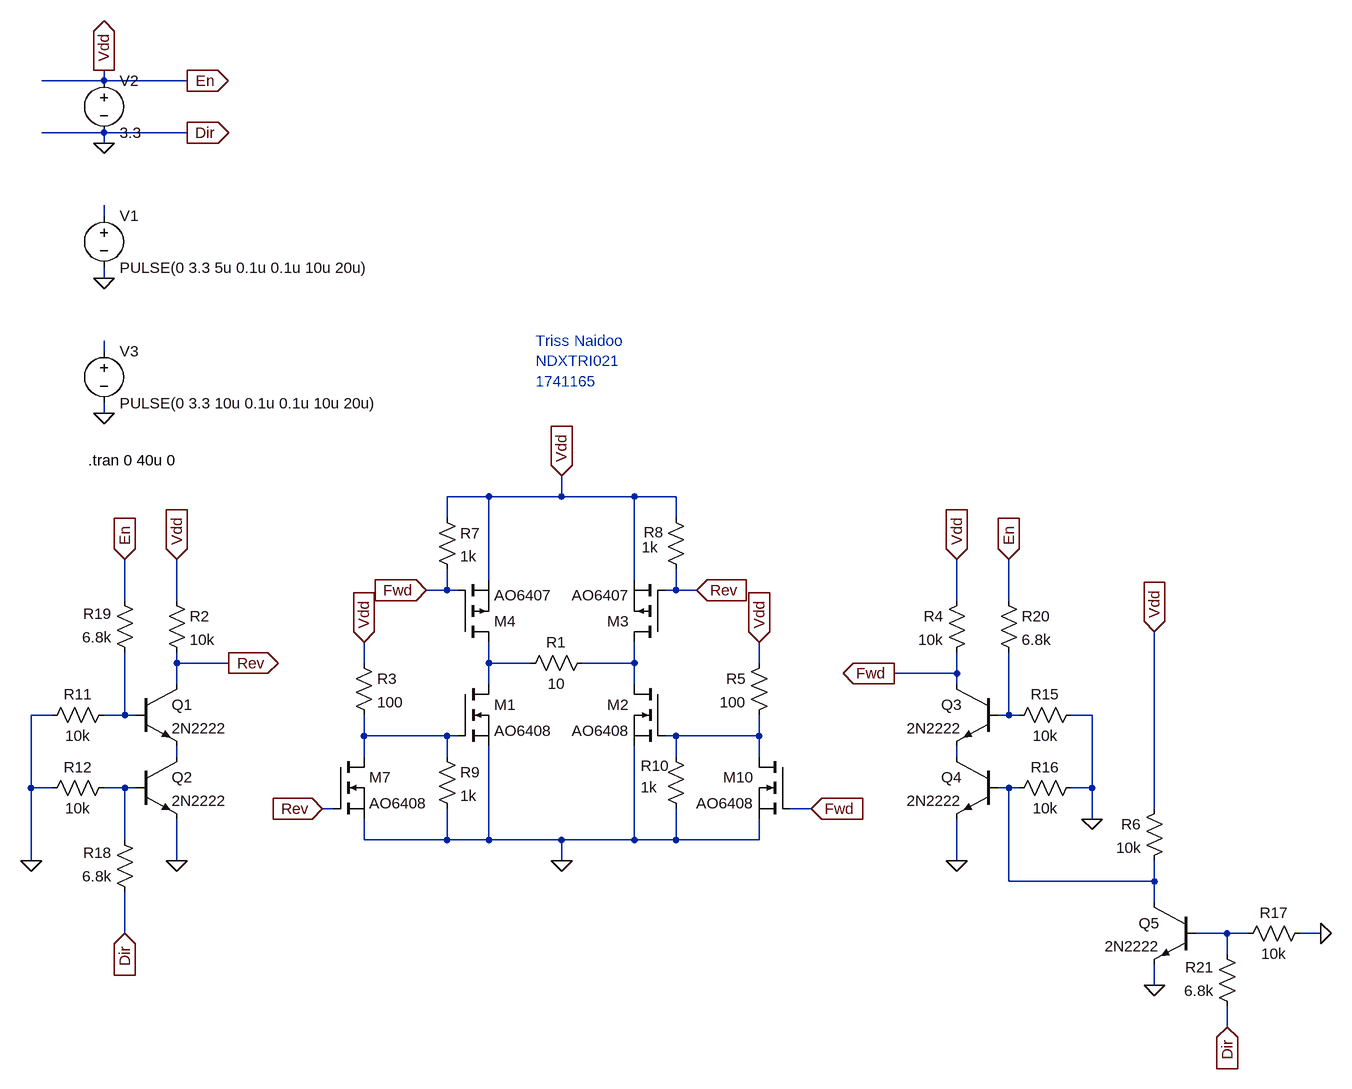
[diagram p0: schematic EEE3088F_MOSFET_Driver_Simulation.asc]
EEE3088F_MOSFET_Driver_Simulation.asc, the LTspice schematic file:
Version 4
SHEET 1 2004 812
WIRE 48 -736 48 -752
WIRE 48 -736 -48 -736
WIRE 176 -736 48 -736
WIRE 48 -656 -48 -656
WIRE 176 -656 48 -656
WIRE 48 -640 48 -656
WIRE 48 -528 48 -544
WIRE 48 -432 48 -448
WIRE 48 -320 48 -336
WIRE 48 -224 48 -240
WIRE 640 -96 576 -96
WIRE 752 -96 752 -128
WIRE 752 -96 640 -96
WIRE 864 -96 752 -96
WIRE 928 -96 864 -96
WIRE 576 -64 576 -96
WIRE 928 -64 928 -96
WIRE 640 32 640 -96
WIRE 864 32 864 -96
WIRE 576 48 576 16
WIRE 576 48 544 48
WIRE 592 48 576 48
WIRE 928 48 928 16
WIRE 928 48 912 48
WIRE 960 48 928 48
WIRE 80 64 80 0
WIRE 160 64 160 0
WIRE 1360 64 1360 0
WIRE 1440 64 1440 0
WIRE 160 160 160 144
WIRE 240 160 160 160
WIRE 448 160 448 128
WIRE 640 160 640 128
WIRE 704 160 640 160
WIRE 864 160 864 128
WIRE 864 160 784 160
WIRE 1056 160 1056 128
WIRE 1360 176 1360 144
WIRE 1360 176 1264 176
WIRE 160 192 160 160
WIRE 640 192 640 160
WIRE 864 192 864 160
WIRE 1360 192 1360 176
WIRE -32 240 -64 240
WIRE 80 240 80 144
WIRE 80 240 48 240
WIRE 96 240 80 240
WIRE 1440 240 1440 144
WIRE 1440 240 1424 240
WIRE 1456 240 1440 240
WIRE 1568 240 1536 240
WIRE 448 272 448 240
WIRE 576 272 448 272
WIRE 592 272 576 272
WIRE 928 272 912 272
WIRE 1056 272 1056 240
WIRE 1056 272 928 272
WIRE 160 304 160 288
WIRE 448 304 448 272
WIRE 576 304 576 272
WIRE 928 304 928 272
WIRE 1056 304 1056 272
WIRE 1360 304 1360 288
WIRE -64 352 -64 240
WIRE -32 352 -64 352
WIRE 80 352 48 352
WIRE 96 352 80 352
WIRE 1440 352 1424 352
WIRE 1456 352 1440 352
WIRE 1568 352 1568 240
WIRE 1568 352 1536 352
WIRE 400 384 384 384
WIRE 1136 384 1104 384
WIRE 1664 384 1664 112
WIRE 1568 400 1568 352
WIRE 80 432 80 352
WIRE 448 432 448 400
WIRE 576 432 576 384
WIRE 576 432 448 432
WIRE 640 432 640 288
WIRE 640 432 576 432
WIRE 752 432 640 432
WIRE 864 432 864 288
WIRE 864 432 752 432
WIRE 928 432 928 384
WIRE 928 432 864 432
WIRE 1056 432 1056 400
WIRE 1056 432 928 432
WIRE -64 464 -64 352
WIRE 160 464 160 400
WIRE 752 464 752 432
WIRE 1360 464 1360 400
WIRE 1440 496 1440 352
WIRE 1664 496 1664 464
WIRE 1664 496 1440 496
WIRE 1664 528 1664 496
WIRE 80 576 80 512
WIRE 1776 576 1728 576
WIRE 1808 576 1776 576
WIRE 1920 576 1888 576
WIRE 1776 608 1776 576
WIRE 1664 656 1664 624
WIRE 1776 720 1776 688
FLAG 752 464 0
FLAG 752 -128 Vdd
IOPIN 752 -128 In
FLAG 48 -640 0
FLAG 48 -432 0
FLAG 176 -736 En
IOPIN 176 -736 Out
FLAG 48 -752 Vdd
IOPIN 48 -752 Out
FLAG 48 -224 0
FLAG 176 -656 Dir
IOPIN 176 -656 Out
FLAG 1664 656 0
FLAG 1920 576 0
FLAG 448 128 Vdd
IOPIN 448 128 In
FLAG 1056 128 Vdd
IOPIN 1056 128 In
FLAG 160 0 Vdd
IOPIN 160 0 In
FLAG 1360 0 Vdd
IOPIN 1360 0 In
FLAG 1664 112 Vdd
IOPIN 1664 112 In
FLAG 160 464 0
FLAG 1360 464 0
FLAG -64 464 0
FLAG 1568 400 0
FLAG 240 160 Rev
IOPIN 240 160 Out
FLAG 960 48 Rev
IOPIN 960 48 In
FLAG 384 384 Rev
IOPIN 384 384 In
FLAG 544 48 Fwd
IOPIN 544 48 In
FLAG 1136 384 Fwd
IOPIN 1136 384 In
FLAG 1264 176 Fwd
IOPIN 1264 176 Out
FLAG 80 0 En
IOPIN 80 0 In
FLAG 1440 0 En
IOPIN 1440 0 In
FLAG 1776 720 Dir
IOPIN 1776 720 In
FLAG 80 576 Dir
IOPIN 80 576 In
SYMBOL res 688 176 R270
WINDOW 0 32 56 VTop 2
WINDOW 3 0 56 VBottom 2
SYMATTR InstName R1
SYMATTR Value 10
SYMBOL nmos 592 192 R0
SYMATTR InstName M1
SYMATTR Value AO6408
SYMBOL nmos 912 192 M0
SYMATTR InstName M2
SYMATTR Value AO6408
SYMBOL pmos 912 128 R180
SYMATTR InstName M3
SYMATTR Value AO6407
SYMBOL pmos 592 128 M180
SYMATTR InstName M4
SYMATTR Value AO6407
SYMBOL voltage 48 -544 R0
WINDOW 123 0 0 Left 0
WINDOW 39 0 0 Left 0
SYMATTR InstName V1
SYMATTR Value PULSE(0 3.3 5u 0.1u 0.1u 10u 20u)
SYMBOL voltage 48 -752 R0
WINDOW 123 0 0 Left 0
WINDOW 39 0 0 Left 0
SYMATTR InstName V2
SYMATTR Value 3.3
SYMBOL res 144 48 R0
SYMATTR InstName R2
SYMATTR Value 10k
SYMBOL nmos 400 304 R0
SYMATTR InstName M7
SYMATTR Value AO6408
SYMBOL res 432 144 R0
SYMATTR InstName R3
SYMATTR Value 100
SYMBOL res 1376 48 M0
SYMATTR InstName R4
SYMATTR Value 10k
SYMBOL nmos 1104 304 M0
SYMATTR InstName M10
SYMATTR Value AO6408
SYMBOL res 1072 144 M0
SYMATTR InstName R5
SYMATTR Value 100
SYMBOL res 1680 368 M0
SYMATTR InstName R6
SYMATTR Value 10k
SYMBOL res 560 288 R0
SYMATTR InstName R9
SYMATTR Value 1k
SYMBOL res 912 288 R0
WINDOW 0 -38 30 Left 2
WINDOW 3 -38 63 Left 2
SYMATTR InstName R10
SYMATTR Value 1k
SYMBOL voltage 48 -336 R0
WINDOW 123 0 0 Left 0
WINDOW 39 0 0 Left 0
SYMATTR InstName V3
SYMATTR Value PULSE(0 3.3 10u 0.1u 0.1u 10u 20u)
SYMBOL res 560 -80 R0
SYMATTR InstName R7
SYMATTR Value 1k
SYMBOL res 912 -80 R0
WINDOW 0 -34 39 Left 2
WINDOW 3 -37 62 Left 2
SYMATTR InstName R8
SYMATTR Value 1k
SYMBOL npn 96 192 R0
SYMATTR InstName Q1
SYMATTR Value 2N2222
SYMBOL npn 96 304 R0
SYMATTR InstName Q2
SYMATTR Value 2N2222
SYMBOL npn 1424 192 M0
SYMATTR InstName Q3
SYMATTR Value 2N2222
SYMBOL npn 1424 304 M0
SYMATTR InstName Q4
SYMATTR Value 2N2222
SYMBOL npn 1728 528 M0
SYMATTR InstName Q5
SYMATTR Value 2N2222
SYMBOL res 96 160 R180
WINDOW 0 36 76 Left 2
WINDOW 3 36 40 Left 2
SYMATTR InstName R19
SYMATTR Value 6.8k
SYMBOL res 64 224 R90
WINDOW 0 0 56 VBottom 2
WINDOW 3 32 56 VTop 2
SYMATTR InstName R11
SYMATTR Value 10k
SYMBOL res 64 336 R90
WINDOW 0 0 56 VBottom 2
WINDOW 3 32 56 VTop 2
SYMATTR InstName R12
SYMATTR Value 10k
SYMBOL res 1552 224 R90
WINDOW 0 0 56 VBottom 2
WINDOW 3 32 56 VTop 2
SYMATTR InstName R15
SYMATTR Value 10k
SYMBOL res 1552 336 R90
WINDOW 0 0 56 VBottom 2
WINDOW 3 32 56 VTop 2
SYMATTR InstName R16
SYMATTR Value 10k
SYMBOL res 1904 560 R90
WINDOW 0 0 56 VBottom 2
WINDOW 3 32 56 VTop 2
SYMATTR InstName R17
SYMATTR Value 10k
SYMBOL res 1424 48 R0
SYMATTR InstName R20
SYMATTR Value 6.8k
SYMBOL res 96 528 R180
WINDOW 0 36 76 Left 2
WINDOW 3 36 40 Left 2
SYMATTR InstName R18
SYMATTR Value 6.8k
SYMBOL res 1792 704 R180
WINDOW 0 36 76 Left 2
WINDOW 3 36 40 Left 2
SYMATTR InstName R21
SYMATTR Value 6.8k
TEXT 24 -152 Left 2 !.tran 0 40u 0
TEXT 712 -336 Left 2 ;Triss Naidoo\nNDXTRI021\n1741165

The netlist it stands for:
* EEE3088F_MOSFET_Driver_Simulation.asc
R1 N003 N004 10
M1 N003 N007 0 0 AO6408
M2 N004 N008 0 0 AO6408
M3 N004 Rev En En AO6407
M4 N003 Fwd En En AO6407
V1 N001 0 PULSE(0 3.3 5u 0.1u 0.1u 10u 20u)
V2 En 0 3.3
R2 En Rev 10k
M7 N007 Rev 0 0 AO6408
R3 En N007 100
R4 En Fwd 10k
M10 N008 Fwd 0 0 AO6408
R5 En N008 100
R6 En N012 10k
R9 N007 0 1k
R10 N008 0 1k
V3 N002 0 PULSE(0 3.3 10u 0.1u 0.1u 10u 20u)
R7 En Fwd 1k
R8 En Rev 1k
Q1 Rev N005 N009 0 2N2222
Q2 N009 N011 0 0 2N2222
Q3 Fwd N006 N010 0 2N2222
Q4 N010 N012 0 0 2N2222
Q5 N012 N013 0 0 2N2222
R19 N005 En 6.8k
R11 N005 0 10k
R12 N011 0 10k
R15 0 N006 10k
R16 0 N012 10k
R17 0 N013 10k
R20 En N006 6.8k
R18 0 N011 6.8k
R21 0 N013 6.8k
.model NPN NPN
.model PNP PNP
.lib standard.bjt
.model NMOS NMOS
.model PMOS PMOS
.lib standard.mos
.tran 0 40u 0
* Triss Naidoo
* NDXTRI021
* 1741165
.backanno
.end